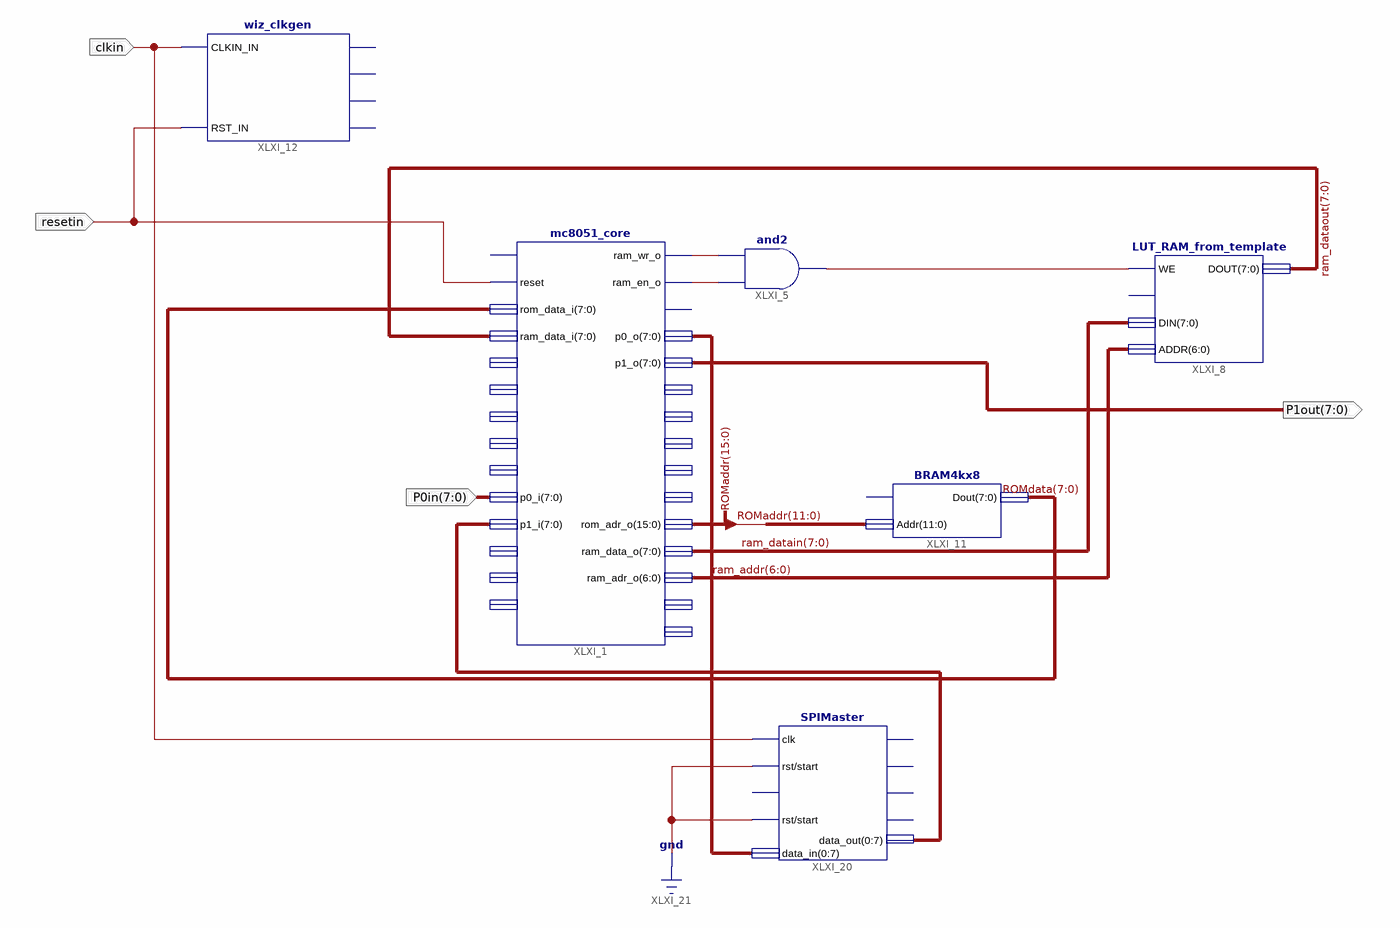
[diagram p0: schematic sheet 1]
// Xilinx ISE schematic top.sch (spartan3e) as structural Verilog: 6 symbols, 4 ports
module top (
  input  resetin,
  input  clkin,
  input  [7:0] P0in,
  output [7:0] P1out
);

  wire XLXN_9, XLXN_10, XLXN_16;
  wire [6:0] ram_addr;
  wire [7:0] ram_datain, ram_dataout, ROMdata, XLXN_46, XLXN_47;
  wire [15:0] ROMaddr;

  mc8051_core XLXI_1 (
    .reset(resetin), .rom_data_i(ROMdata), .ram_data_i(ram_dataout), .p0_i(P0in), .p1_i(XLXN_47),
    .ram_wr_o(XLXN_9), .ram_en_o(XLXN_10), .p0_o(XLXN_46), .p1_o(P1out), .rom_adr_o(ROMaddr),
    .ram_data_o(ram_datain), .ram_adr_o(ram_addr));  // open: clk, int0_i, int1_i, all_t0_i, all_t1_i, all_rxd_i, p2_i, p3_i, datax_i, wrx_o, p2_o, p3_o, all_rxd_o, all_txd_o, all_rxdwr_o, datax_o, adrx_o
  and XLXI_5 (XLXN_16, XLXN_10, XLXN_9);
  LUT_RAM_from_template XLXI_8 (.WE(XLXN_16), .DIN(ram_datain), .ADDR(ram_addr), .DOUT(ram_dataout));  // open: CLK
  BRAM4kx8 XLXI_11 (.Addr(ROMaddr[11:0]), .Dout(ROMdata));  // open: clkin
  wiz_clkgen XLXI_12 (.CLKIN_IN(clkin), .RST_IN(resetin));  // open: CLKDV_OUT, CLKIN_IBUFG_OUT, CLK0_OUT, LOCKED_OUT
  SPIMaster XLXI_20 (
    .clk(clkin), .rst(1'b0), .start(1'b0), .data_out(XLXN_47), .data_in(XLXN_46));  // open: miso, mosi, sck, busy, new_data
endmodule
